# EAGLE schematic Makita_PSU (EAGLE 9.6.2)
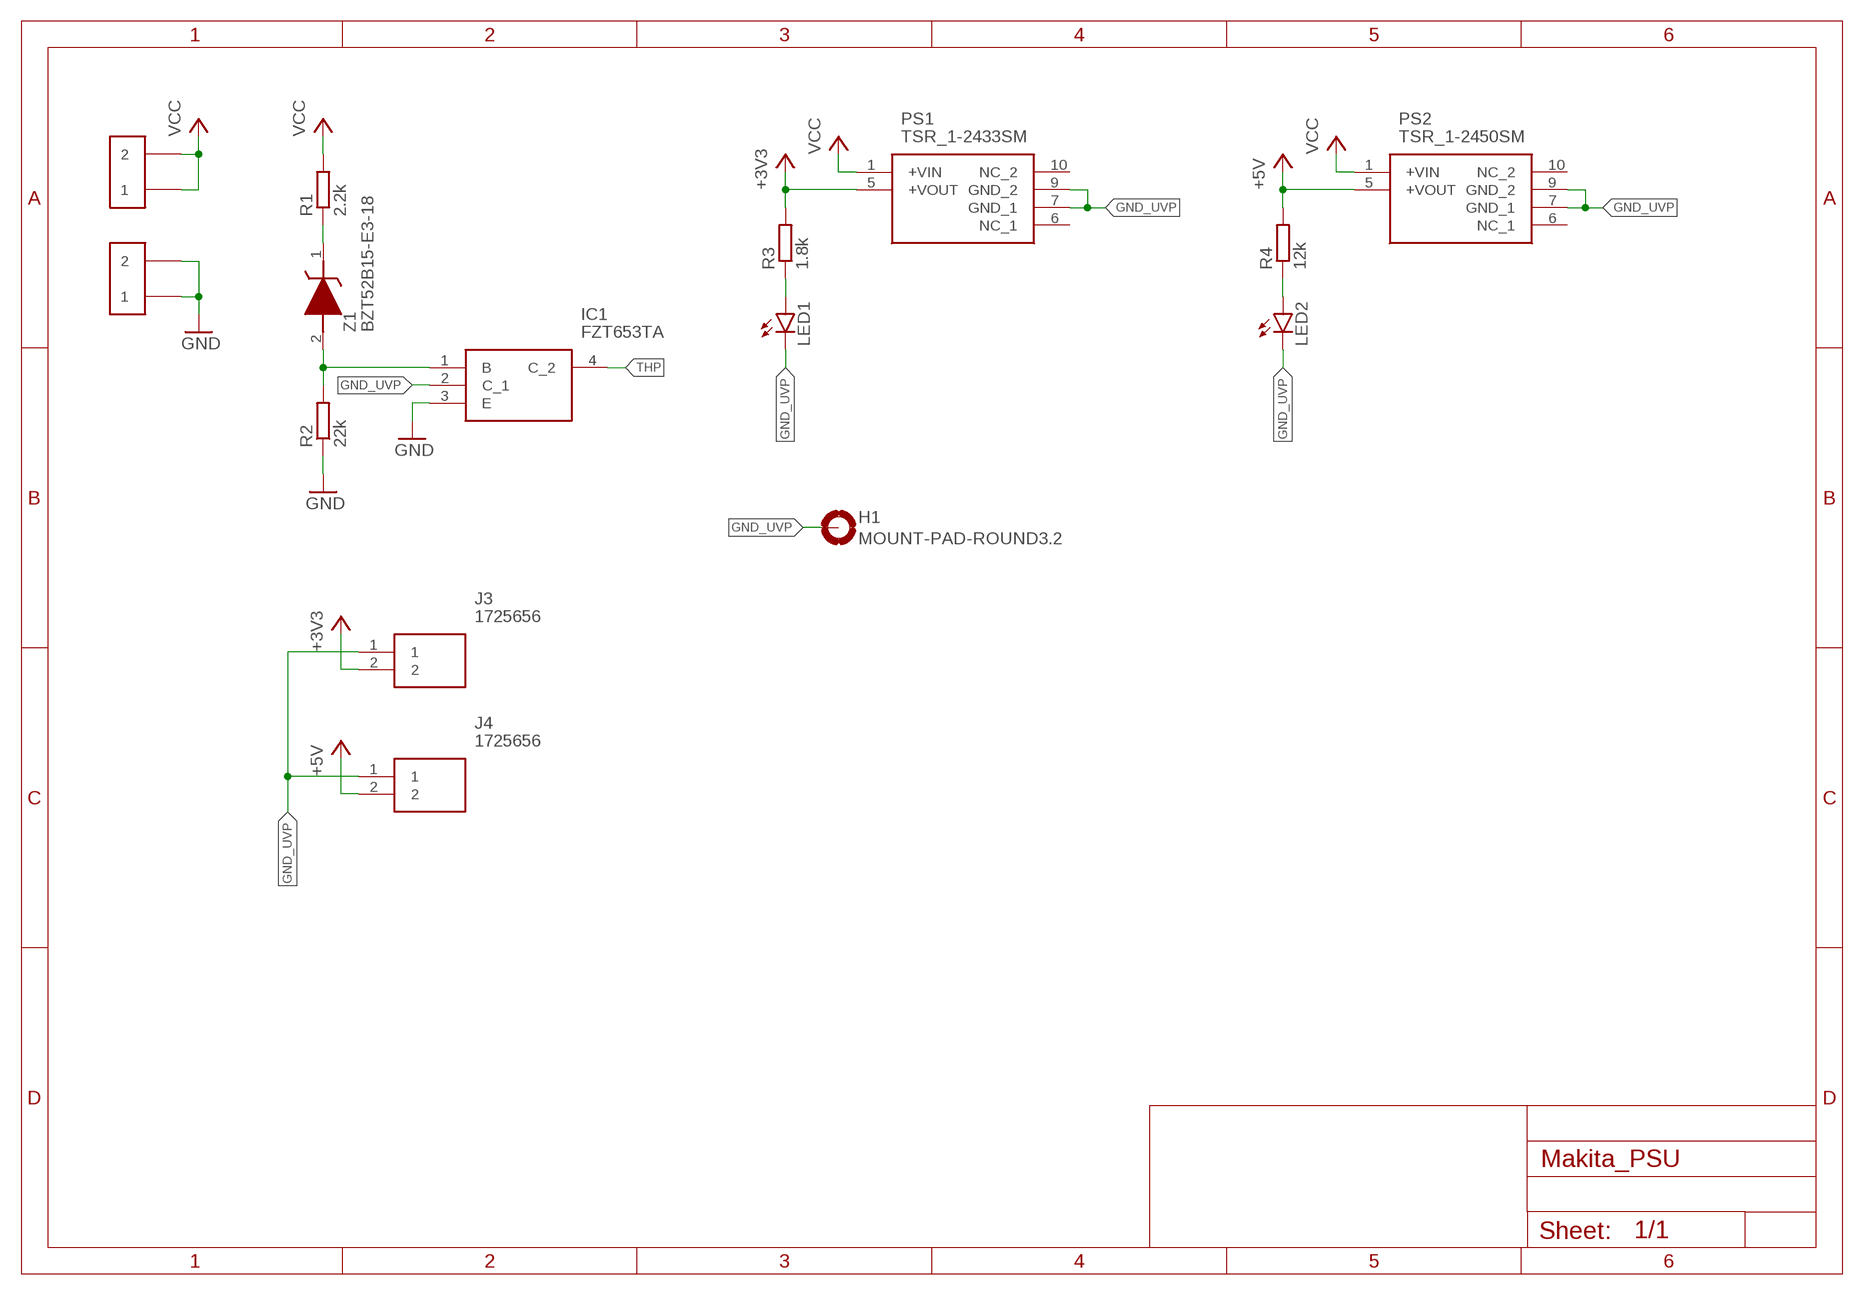
[diagram p0: schematic, sheet 1]

## Parts
H1  MOUNT-PAD-ROUND3.2  [3,2-PAD]
IC1  FZT653TA  [SOT230P700X180-4N]
J1  VOGT_3825Z.68  [VOGT_3825Z.68]
J2  VOGT_3825Z.68  [VOGT_3825Z.68]
J3  1725656  [1725656]
J4  1725656  [1725656]
LED1  LEDCHIPLED_0805  [CHIPLED_0805]
LED2  LEDCHIPLED_0805  [CHIPLED_0805]
PS1  TSR_1-2433SM  [TSR124120SM]
PS2  TSR_1-2450SM  [TSR124120SM]
R1  2.2k  R-EU_R0805  [R0805]
R2  22k  R-EU_R0805  [R0805]
R3  1.8k  R-EU_R0805  [R0805]
R4  12k  R-EU_R0805  [R0805]
Z1  BZT52B15-E3-18  [SOD3716X135N]

## Nets
+3V3: J3.2 PS1.5(+VOUT) R3.2
+5V: J4.2 PS2.5(+VOUT) R4.2
GND: IC1.3(E) J2.P$1 J2.P$2 R2.1
GND_UVP: H1.B3,2(MOUNT) IC1.2(C_1) J3.1 J4.1 LED1.C LED2.C PS1.7(GND_1) PS1.9(GND_2) PS2.7(GND_1) PS2.9(GND_2)
N$1: IC1.1(B) R2.2 Z1.2(A)
N$2: R1.1 Z1.1(K)
N$3: LED1.A R3.1
N$5: LED2.A R4.1
THP: IC1.4(C_2)
VCC: J1.P$1 J1.P$2 PS1.1(+VIN) PS2.1(+VIN) R1.2
Unconnected: PS1.6(NC_1) PS1.10(NC_2) PS2.6(NC_1) PS2.10(NC_2)

## Library data of the parts
H1 = holes:MOUNT-PAD-ROUND: MOUNTING PAD, round
IC1 = FlS:FZT653TA: Bipolar Transistors - BJT NPN Medium Power Source: Datasheet <https://datasheet.datasheetarchive.com/originals/distributors/Datasheets-DGA18/1087531.pdf>; DESCRIPTION: Bipolar Transistors - BJT NPN Medium Power; HEIGHT: 1.8mm; MANUFACTURER_NAME: Diodes Inc.; MANUFACTURER_PART_NUMBER: FZT653TA; MOUSER_PART_NUMBER: 522-FZT653TA; MOUSER_PRICE-STOCK: https://www.mouser.co.uk/ProductDetail/Diodes-Incorporated/FZT653TA?qs=rI7uf1IzohQqmHMCtqURKQ%3D%3D
J1 J2 = FlS:VOGT_3825Z.68
J3 J4 = FlS:1725656: PCB terminal block, nominal current: 6 A, rated voltage (III/2): 160 V, nominal cross section: 0.5 mm?, Number of potentials: 2, Number of rows: 1, Number of positions per row: 2, product range: MPT 0,5, pitch: 2.54 mm, connection method: Screw connection with tension sleeve, mounting: Wave soldering, conductor/PCB connection direction: 0 ?, color: green, Pin layout: Linear pinning, Solder pin [P]: 3.5 mm, type of packaging: packed in cardboard Source: Datasheet <https://www.phoenixcontact.com/online/portal/us/?uri=pxc-oc-itemdetail:pid=1725656&library=usen&pcck=P-11-01-05&tab=1&selectedCategory=ALL>; DESCRIPTION: PCB terminal block, nominal current: 6 A, rated voltage (III/2): 160 V, nominal cross section: 0.5 mm?, Number of potentials: 2, Number of rows: 1, Number of positions per row: 2, product range: MPT 0,5, pitch: 2.54 mm, connection method: Screw connection with tension sleeve, mounting: Wave soldering, conductor/PCB connection direction: 0 ?, color: green, Pin layout: Linear pinning, Solder pin [P]: 3.5 mm, type of packaging: packed in cardboard; HEIGHT: 8.65mm; MANUFACTURER_NAME: Phoenix Contact; MANUFACTURER_PART_NUMBER: 1725656; MOUSER_PART_NUMBER: 651-1725656; MOUSER_PRICE-STOCK: https://www.mouser.co.uk/ProductDetail/Phoenix-Contact/1725656?qs=Ul7CXFMnlWWQeccayYbRmw%3D%3D
LED1 LED2 = led:LED: LED OSRAM: - CHIPLED LG R971, LG N971, LY N971, LG Q971, LY Q971, LO R971, LY R971 LH N974, LH R974 LS Q976, LO Q976, LY Q976 LO Q996 - Hyper CHIPLED LW Q18S LB Q993, LB Q99A, LB R99A - SideLED LS A670, LO A670, LY A670, LG A670, LP A670 LB A673, LV A673, LT A673, LW A673 LH A674 LY A675 LS A676, LA A676, LO A676, LY A676, LW A676 LS A679, LY A679, LG A679 - Hyper Micro SIDELED® LS Y876, LA Y876, LO Y876, LY Y876 LT Y87S - SmartLED LW L88C, LW L88S LB L89C, LB L89S, LG L890 LS L89K, LO L89K, LY L89K LS L896, LA L896, LO L896, LY L896 - TOPLED LS T670, LO T670, LY T670, LG T670, LP T670 LSG T670, LSP T670, LSY T670, LOP T670, LYG T670 LG T671, LOG T671, LSG T671 LB T673, LV T673, LT T673, LW T673 LH T674 LS T676, LA T676, LO T676, LY T676, LB T676, LH T676, LSB T676, LW T676 LB T67C, LV T67C, LT T67C, LS T67K, LO T67K, LY T67K, LW E67C LS E67B, LA E67B, LO E67B, LY E67B, LB E67C, LV E67C, LT E67C LW T67C LS T679, LY T679, LG T679 LS T770, LO T770, LY T770, LG T770, LP T770 LB T773, LV T773, LT T773, LW T773 LH T774 LS E675, LA E675, LY E675, LS T675 LS T776, LA T776, LO T776, LY T776, LB T776 LHGB T686 LT T68C, LB T68C - Hyper Mini TOPLED® LB M676 - Mini TOPLED Santana® LG M470 LS M47K, LO M47K, LY M47K Source: http://www.osram.convergy.de LUXEON: - LUMILED® LXK2-PW12-R00, LXK2-PW12-S00, LXK2-PW14-U00, LXK2-PW14-V00 LXK2-PM12-R00, LXK2-PM12-S00, LXK2-PM14-U00 LXK2-PE12-Q00, LXK2-PE12-R00, LXK2-PE12-S00, LXK2-PE14-T00, LXK2-PE14-U00 LXK2-PB12-K00, LXK2-PB12-L00, LXK2-PB12-M00, LXK2-PB14-N00, LXK2-PB14-P00, LXK2-PB14-Q00 LXK2-PR12-L00, LXK2-PR12-M00, LXK2-PR14-Q00, LXK2-PR14-R00 LXK2-PD12-Q00, LXK2-PD12-R00, LXK2-PD12-S00 LXK2-PH12-R00, LXK2-PH12-S00 LXK2-PL12-P00, LXK2-PL12-Q00, LXK2-PL12-R00 Source: www.luxeon.com KINGBRIGHT: KA-3528ASYC Source: www.kingbright.com
PS1 = FlS:TSR_1-2433SM: 1 Amp POL switching regulator, 3.0 to -36 VDC input, pos.-pos. circuit, SMD package Source: Datasheet <https://tracopower.com/tsr1sm-datasheet/>; DESCRIPTION: 1 Amp POL switching regulator, 3.0 to -36 VDC input, pos.-pos. circuit, SMD package; HEIGHT: 7.6mm; MANUFACTURER_NAME: Traco Power; MANUFACTURER_PART_NUMBER: TSR 1-2433SM; MOUSER_PART_NUMBER: 495-TSR1-2433SM; MOUSER_PRICE-STOCK: https://www.mouser.co.uk/ProductDetail/TRACO-Power/TSR-1-2433SM?qs=7DKAAOw6jrii6flqzVbLkA%3D%3D
PS2 = FlS:TSR_1-2450SM: 1 Amp POL switching regulator, 3.0 to -36 VDC input, pos.-pos. circuit, SMD package Source: Datasheet <https://tracopower.com/tsr1sm-datasheet/>; DESCRIPTION: 1 Amp POL switching regulator, 3.0 to -36 VDC input, pos.-pos. circuit, SMD package; HEIGHT: 7.6mm; MANUFACTURER_NAME: Traco Power; MANUFACTURER_PART_NUMBER: TSR 1-2450SM; MOUSER_PART_NUMBER: 495-TSR1-2450SM; MOUSER_PRICE-STOCK: https://www.mouser.co.uk/ProductDetail/TRACO-Power/TSR-1-2450SM?qs=7DKAAOw6jrikgapa5Q3iJg%3D%3D
R1-R4 = rcl:R-EU_: RESISTOR, European symbol; SPICEPREFIX: R
Z1 = FlS:BZT52B15-E3-18: Zener Diodes 15 Volt 0.5W 2% Source: Datasheet <https://www.vishay.com/docs/85760/bzt52.pdf>; DESCRIPTION: Zener Diodes 15 Volt 0.5W 2%; HEIGHT: 1.35mm; MANUFACTURER_NAME: Vishay; MANUFACTURER_PART_NUMBER: BZT52B15-E3-18; MOUSER_PART_NUMBER: 78-BZT52B15-E3-18; MOUSER_PRICE-STOCK: https://www.mouser.co.uk/ProductDetail/Vishay-Semiconductors/BZT52B15-E3-18?qs=KP8Io%2FXyE5SvlbRZ336LSg%3D%3D